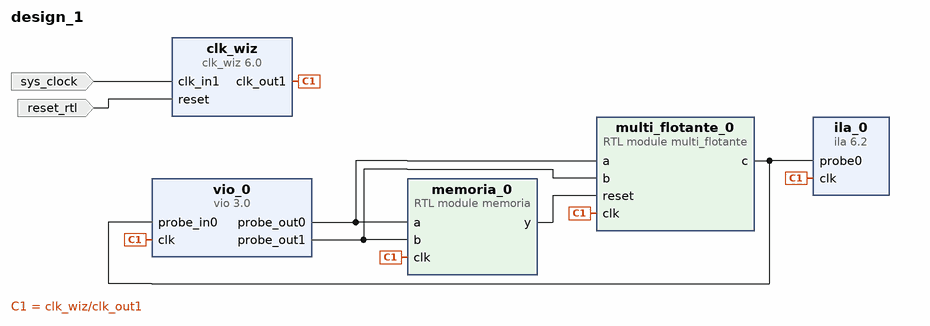
[diagram p0: block diagram of the top level]
# Vivado block design design_1, xc7z010clg400-1, Vivado 2020.2
create_bd_design design_1

create_bd_port -dir I -type clk sys_clock
set_property -dict {CONFIG.FREQ_HZ 125000000 CONFIG.PHASE 0.000} [get_bd_ports sys_clock]
create_bd_port -dir I -type rst reset_rtl
set_property -dict {CONFIG.POLARITY ACTIVE_HIGH} [get_bd_ports reset_rtl]

create_bd_cell -type module -reference multi_flotante multi_flotante_0
create_bd_cell -type module -reference memoria memoria_0
create_bd_cell -type ip -vlnv xilinx.com:ip:vio:3.0 vio_0
set_property -dict {CONFIG.C_NUM_PROBE_OUT 2 CONFIG.C_PROBE_OUT0_WIDTH 32 CONFIG.C_PROBE_OUT1_WIDTH 32} [get_bd_cells vio_0]
create_bd_cell -type ip -vlnv xilinx.com:ip:clk_wiz:6.0 clk_wiz
set_property -dict {CONFIG.CLK_IN1_BOARD_INTERFACE sys_clock CONFIG.USE_BOARD_FLOW true} [get_bd_cells clk_wiz]
create_bd_cell -type ip -vlnv xilinx.com:ip:ila:6.2 ila_0
set_property -dict [list \
  CONFIG.C_ENABLE_ILA_AXI_MON false \
  CONFIG.C_MONITOR_TYPE Native \
  CONFIG.C_NUM_OF_PROBES 1 \
  CONFIG.C_PROBE0_WIDTH 32 \
] [get_bd_cells ila_0]

# ---- connections ----

connect_bd_net [get_bd_pins clk_wiz/clk_out1] \
  [get_bd_pins multi_flotante_0/clk] [get_bd_pins memoria_0/clk] [get_bd_pins vio_0/clk] [get_bd_pins ila_0/clk]
connect_bd_net [get_bd_pins vio_0/probe_out0] [get_bd_pins memoria_0/a] [get_bd_pins multi_flotante_0/a]
connect_bd_net [get_bd_pins vio_0/probe_out1] [get_bd_pins memoria_0/b] [get_bd_pins multi_flotante_0/b]
connect_bd_net [get_bd_pins memoria_0/y] [get_bd_pins multi_flotante_0/reset]
connect_bd_net [get_bd_pins multi_flotante_0/c] [get_bd_pins vio_0/probe_in0] [get_bd_pins ila_0/probe0]
connect_bd_net [get_bd_ports sys_clock] [get_bd_pins clk_wiz/clk_in1]
connect_bd_net [get_bd_ports reset_rtl] [get_bd_pins clk_wiz/reset]

validate_bd_design
save_bd_design
